# EAGLE design molex-header (EAGLE 9.6.2)
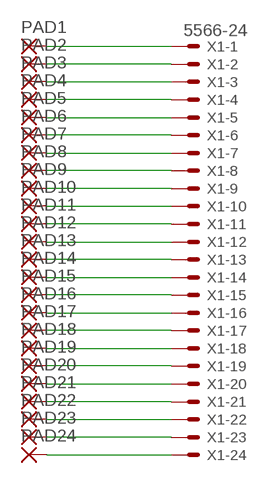
[diagram p0: schematic, sheet 1]

## Parts
PAD1  SMD5  [SMD2,54-5,08]
PAD2  SMD5  [SMD2,54-5,08]
PAD3  SMD5  [SMD2,54-5,08]
PAD4  SMD5  [SMD2,54-5,08]
PAD5  SMD5  [SMD2,54-5,08]
PAD6  SMD5  [SMD2,54-5,08]
PAD7  SMD5  [SMD2,54-5,08]
PAD8  SMD5  [SMD2,54-5,08]
PAD9  SMD5  [SMD2,54-5,08]
PAD10  SMD5  [SMD2,54-5,08]
PAD11  SMD5  [SMD2,54-5,08]
PAD12  SMD5  [SMD2,54-5,08]
PAD13  SMD5  [SMD2,54-5,08]
PAD14  SMD5  [SMD2,54-5,08]
PAD15  SMD5  [SMD2,54-5,08]
PAD16  SMD5  [SMD2,54-5,08]
PAD17  SMD5  [SMD2,54-5,08]
PAD18  SMD5  [SMD2,54-5,08]
PAD19  SMD5  [SMD2,54-5,08]
PAD20  SMD5  [SMD2,54-5,08]
PAD21  SMD5  [SMD2,54-5,08]
PAD22  SMD5  [SMD2,54-5,08]
PAD23  SMD5  [SMD2,54-5,08]
PAD24  SMD5  [SMD2,54-5,08]
X1  5566-24  [5566-24]

## Nets
N$1: PAD1.1(P) X1.1
N$2: PAD2.1(P) X1.2
N$3: PAD3.1(P) X1.3
N$4: PAD4.1(P) X1.4
N$5: PAD5.1(P) X1.5
N$6: PAD6.1(P) X1.6
N$7: PAD7.1(P) X1.7
N$8: PAD8.1(P) X1.8
N$9: PAD9.1(P) X1.9
N$10: PAD10.1(P) X1.10
N$11: PAD11.1(P) X1.11
N$12: PAD12.1(P) X1.12
N$13: PAD13.1(P) X1.13
N$14: PAD14.1(P) X1.14
N$15: PAD15.1(P) X1.15
N$16: PAD16.1(P) X1.16
N$17: PAD17.1(P) X1.17
N$18: PAD18.1(P) X1.18
N$19: PAD19.1(P) X1.19
N$20: PAD20.1(P) X1.20
N$21: PAD21.1(P) X1.21
N$22: PAD22.1(P) X1.22
N$23: PAD23.1(P) X1.23
N$24: PAD24.1(P) X1.24

## Library data of the parts
PAD1-PAD24 = wirepad:SMD5: SMD PAD
X1 = con-molex:5566-24: Mini FIT connector 24 pol Source: http://www.molex.com; MF: MOLEX; OC_FARNELL: unknown; OC_NEWARK: unknown

## Board
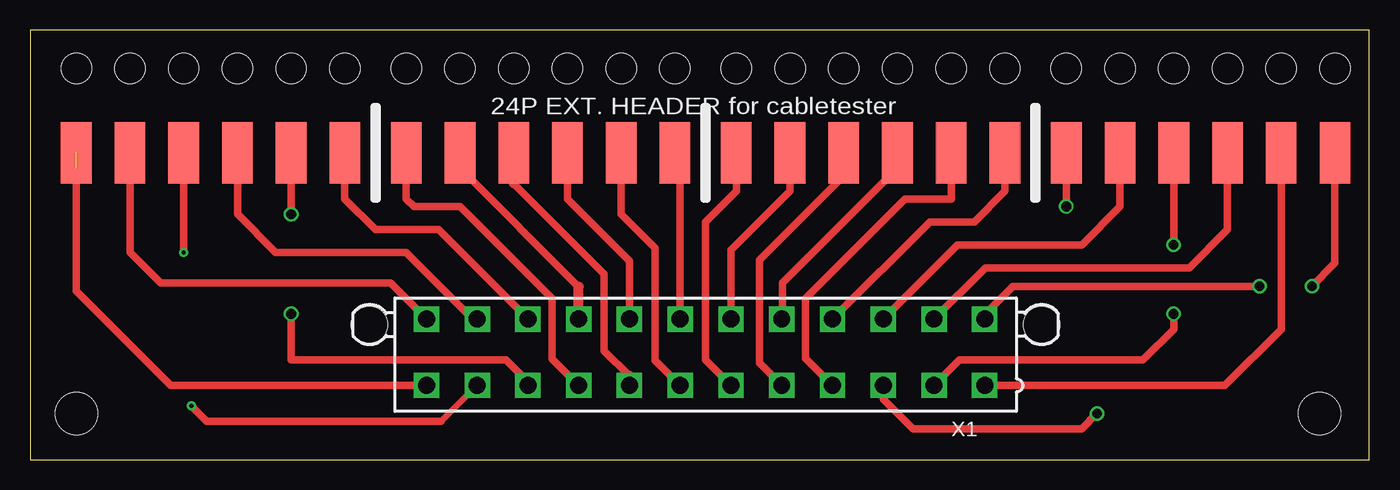
[diagram p1: board, top side]
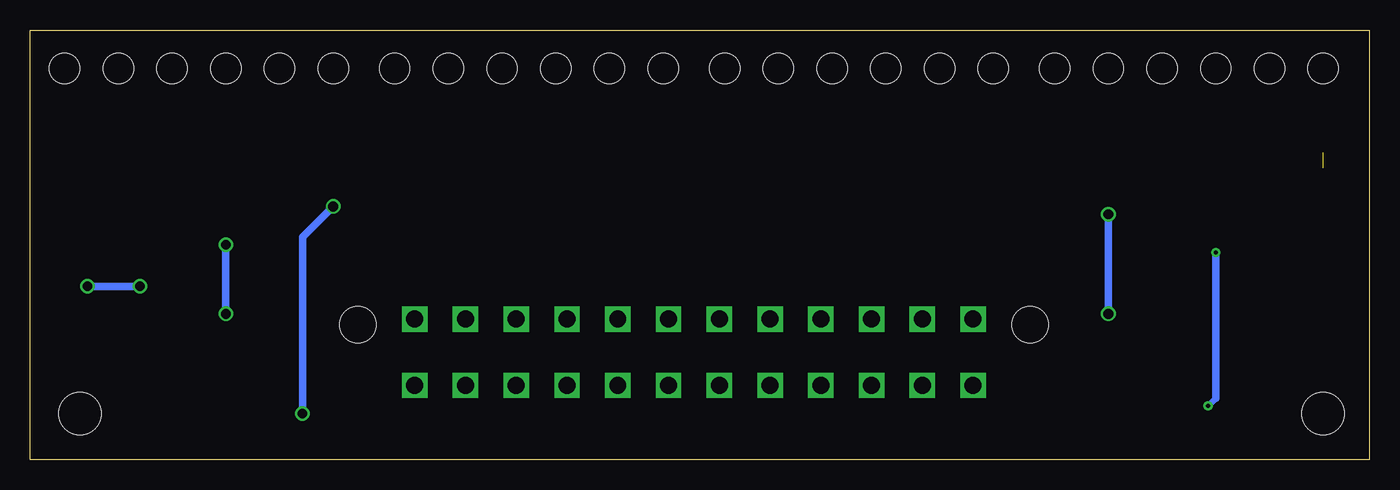
[diagram p2: board, bottom side, seen from below]

Size 110.8 x 35.55 mm. Coordinates in mm from the lower left corner, seen from the top.
Outline: 0,0 110.8,0 110.8,35.55 0,35.55 0,0
Copper layers (1*16): Top 0.035mm / dielectric 1.5mm / Bottom 0.035mm
Design rules "default": minimum track width 6mil, minimum drill 0.35mm, track to track 6mil, track to pad 6mil, pad to pad 6mil, via to via 6mil, smd to smd 6mil, copper to edge 40mil, drill to drill 6mil, minimum pad ring 10mil, minimum via ring 8mil, stop-mask expansion 4mil, vias tented up to drill 0mil, thermal gap 10mil
Holes 2.5 mm at 3.81,32.38 8.26,32.38 12.7,32.38 17.14,32.38 21.59,32.38 26.04,32.38 31.11,32.38 35.56,32.38 40.01,32.38 44.45,32.38 48.9,32.38 53.34,32.38 58.42,32.38 62.87,32.38 67.31,32.38 71.75,32.38 76.2,32.38 80.64,32.38 85.72,32.38 90.17,32.38 94.61,32.38 99.06,32.38 103.5,32.38 107.95,32.38
Holes 3.5 mm at 3.81,3.81 106.68,3.81

### Footprints (pad centres in the part's own frame; a part is rotated, then mirrored left to right if it is on the bottom)
SMD2,54-5,08 = smd 2.54 x 5.08: 1 0,0
5566-24 = drill 1.4 square: 1 23.1,-2.75; 2 18.9,-2.75; 3 14.7,-2.75; 4 10.5,-2.75; 5 6.3,-2.75; 6 2.1,-2.75; 7 -2.1,-2.75; 8 -6.3,-2.75; 9 -10.5,-2.75; 10 -14.7,-2.75; 11 -18.9,-2.75; 12 -23.1,-2.75; 13 23.1,2.75; 14 18.9,2.75; 15 14.7,2.75; 16 10.5,2.75; 17 6.3,2.75; 18 2.1,2.75; 19 -2.1,2.75; 20 -6.3,2.75; 21 -10.5,2.75; 22 -14.7,2.75; 23 -18.9,2.75; 24 -23.1,2.75 | hole 3: 27.8,2.29; -27.8,2.29

### Placement (x,y rotation side)
PAD1  103.5,25.4 0 top
PAD2  94.61,25.4 0 top
PAD3  85.72,25.4 0 top
PAD4  76.2,25.4 0 top
PAD5  67.31,25.4 0 top
PAD6  58.42,25.4 0 top
PAD7  48.9,25.4 0 top
PAD8  40.01,25.4 0 top
PAD9  31.11,25.4 0 top
PAD10  21.59,25.4 0 top
PAD11  12.7,25.4 0 top
PAD12  3.81,25.4 0 top
PAD13  107.95,25.4 0 top
PAD14  99.06,25.4 0 top
PAD15  90.17,25.4 0 top
PAD16  80.64,25.4 0 top
PAD17  71.75,25.4 0 top
PAD18  62.87,25.4 0 top
PAD19  53.34,25.4 0 top
PAD20  44.45,25.4 0 top
PAD21  35.56,25.4 0 top
PAD22  26.04,25.4 0 top
PAD23  17.14,25.4 0 top
PAD24  8.26,25.4 0 top
X1  55.88,8.89 0 top

### Tracks (layer width: path | path; a pad name or v marks a point on that pad's centre or on a via)
N$1
  Top 0.61: PAD1.1 103.5,10.79 98.85,6.14 X1.1
N$2  (via drill 0.8)
  Top 0.61: X1.2 76.89,8.26 92.08,8.26 94.61,10.79 v94.61,12.06 | PAD2.1 v94.61,17.78
  Bottom 0.61: v94.61,17.78 v94.61,12.06
N$3  (via drill 0.8)
  Top 0.61: X1.3 70.58,4.99 73.03,2.54 87,2.54 v88.27,3.81 | PAD3.1 v85.72,20.95
  Bottom 0.61: v88.27,3.81 88.27,18.41 v85.72,20.95
N$4
  Top 0.61: X1.4 64.14,8.38 64.14,13.34 72.39,21.59 76.2,21.59 PAD4.1
N$5
  Top 0.61: X1.5 60.33,8 60.33,16.51 67.31,23.5 PAD5.1
N$6
  Top 0.61: X1.6 55.88,8.24 55.88,19.68 58.42,22.23 PAD6.1
  Top 0.813: 58.42,26.04 PAD6.1
N$7
  Top 0.61: X1.7 51.69,8.23 51.69,17.53 48.9,20.32 PAD7.1
  Top 0.813: 48.9,26.67 PAD7.1 48.9,26.04
N$8
  Top 0.61: 40.01,22.86 47.5,15.37 47.5,9.02 49.58,6.93
  Top 0.813: X1.8 49.58,6.93 | 40.01,22.86 PAD8.1
N$9
  Top 0.61: X1.9 43.18,8.34 43.18,13.34 35.56,20.95 31.75,20.95 31.11,21.59 PAD9.1
N$10  (via drill 0.8)
  Top 0.61: 41.18,6.45 39.37,8.26 21.59,8.26 v21.59,12.06 | v21.59,20.32 PAD10.1
  Top 0.813: X1.10 41.18,6.45
  Bottom 0.61: v21.59,20.32 v21.59,12.06
N$11  (via drill 0.35)
  Top 0.508: X1.11 34.02,3.17
  Top 0.61: PAD11.1 v12.7,17.14 | v13.34,4.45 14.61,3.17 34.02,3.17
  Bottom 0.508: 12.7,5.08 v13.34,4.45
  Bottom 0.61: v12.7,17.14 12.7,5.08
N$12  (1 unrouted)
  Top 0.61: X1.12 11.64,6.14 3.81,13.97 3.81,24.13
N$13  (via drill 0.8)
  Top 0.61: v101.73,14.35 81.31,14.35 78.98,12.02 X1.13 | PAD13.1 107.95,16.26 v106.05,14.35
  Bottom 0.61: v106.05,14.35 v101.73,14.35
N$14
  Top 0.61: X1.14 79.02,15.88 95.89,15.88 99.06,19.05 PAD14.1
N$15
  Top 0.61: X1.15 76.72,17.78 87,17.78 90.17,20.95 PAD15.1
N$16
  Top 0.61: X1.16 74.42,19.68 78.11,19.68 80.64,22.23 PAD16.1
N$17
  Top 0.61: 62.23,11.69 62.23,14.61 71.12,23.5
  Top 0.813: X1.17 62.23,11.69 | 71.75,24.13 PAD17.1 72.39,24.77 72.39,23.5 71.12,23.5
N$18
  Top 0.61: X1.18 57.98,17.34 62.87,22.23 PAD18.1
N$19
  Top 0.61: 53.78,24.96 X1.19
  Top 0.813: PAD19.1 53.78,24.96
N$20
  Top 0.61: X1.20 49.58,16.46 44.45,21.59 PAD20.1
  Top 0.813: 44.45,26.67 PAD20.1
N$21
  Top 0.61: 45.38,14.31 35.56,24.13
  Top 0.813: X1.21 45.38,14.31 | 35.56,24.13 PAD21.1
N$22
  Top 0.61: X1.22 33.77,19.05 28.57,19.05 26.04,21.59 PAD22.1
N$23
  Top 0.61: PAD23.1 17.14,20.32 20.32,17.14 31.11,17.14 36.62,11.64
  Top 0.813: X1.23 36.62,11.64
N$24
  Top 0.61: X1.24 29.82,14.61 10.79,14.61 8.26,17.14 PAD24.1

### Text on the board
tNames: 24P EXT. HEADER for cabletester